# Altium schematic sheet differential receiver.SchDoc
size A; SheetNumber: 1; SheetTotal: 2
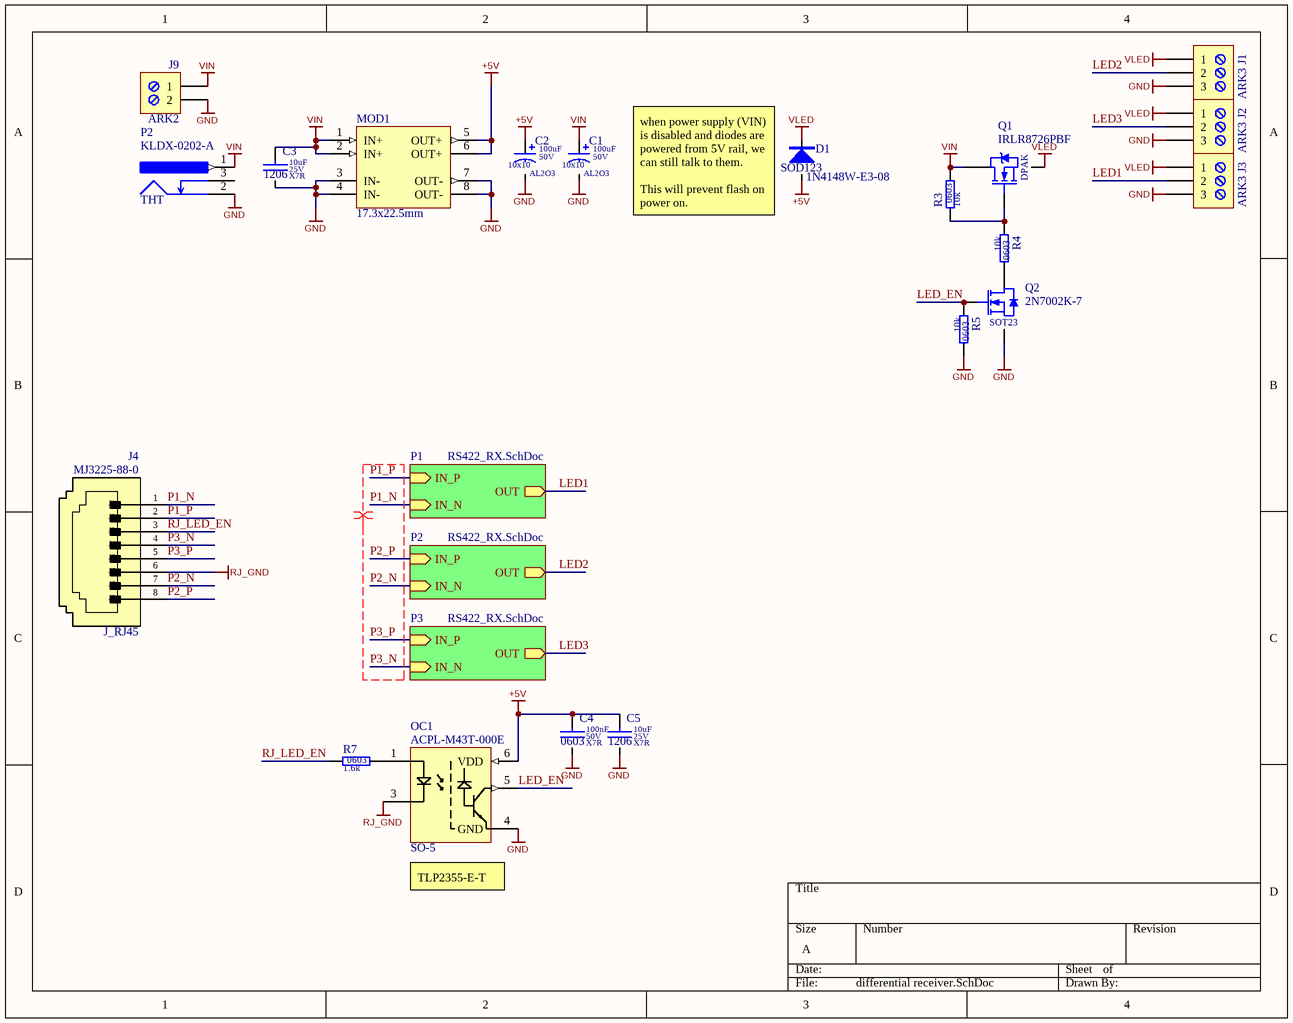
[diagram p0: differential receiver.SchDoc]

## Parts
C1  value 100uF  Dielectric: AL2O3  SCH_Footprint: 10x10  Voltage: 50V  [CE_D_10x10_SMD]  (hidden comment: Electrolytic Capacitor)
C2  value 100uF  Dielectric: AL2O3  SCH_Footprint: 10x10  Voltage: 50V  [CE_D_10x10_SMD]  (hidden comment: Electrolytic Capacitor)
C3  value 10uF  Dielectric: X7R  Voltage: 25V  SCH_Footprint: 1206  [C_1206_3216]  (hidden comment: Ceramic X7R)
C4  value 100nF  Dielectric: X7R  Voltage: 50V  SCH_Footprint: 0603  [C_0603_1608]  (hidden comment: Ceramic X7R)
C5  value 10uF  Dielectric: X7R  Voltage: 25V  SCH_Footprint: 1206  [C_1206_3216]  (hidden comment: Ceramic X7R)
D1  value 1N4148W-E3-08  [SOD123]  (hidden comment: 1N4148W)
J1  ARK3  [J_ARK3]
J2  ARK3  [J_ARK3]
J3  ARK3  [J_ARK3]
J4  value MJ3225-88-0  [J_RJ45_MJ3225-88-0]  (hidden comment: Modular Connector, Modular Jack, 1 x 1 (Port), 8P8C, Cat3)
J9  ARK2  [J_ARK2]
MOD1  SCH_Footprint: 17.3x22.5mm  [MOD_BUCK_MP1584]  (hidden comment: Low cost, Aliexpress-ready DC-DC buck converter using MP1584)
OC1  value ACPL-M43T-000E  [SO-5]  (hidden comment: Optocoupler DC-IN 1-CH Transistor With Base DC-OUT Automotive)
P2  value KLDX-0202-A  SCH_Footprint: THT  [P_KLDX-0202-A]  (hidden comment: DC JACK)
Q1  SCH_Footprint: DPAK  [DPAK_TO252-3_SC63_M]  (hidden comment: IRLR8726PBF)
Q2  SCH_Footprint: SOT23  [SOT23_TO236_SC59]  (hidden comment: 2N7002K-7)
R3  value 10k  SCH_Footprint: 0603  [R_0603_1608]  (hidden comment: Resistor)
R4  value 10k  SCH_Footprint: 0603  [R_0603_1608]  (hidden comment: Resistor)
R5  value 10k  SCH_Footprint: 0603  [R_0603_1608]  (hidden comment: Resistor)
R7  value 1.6k  SCH_Footprint: 0603  [R_0603_1608]  (hidden comment: Resistor)

## Sub-sheets
P1 = RS422_RX.SchDoc: OUT (out), IN_P (in), IN_N (in)
P2 = RS422_RX.SchDoc: OUT (out), IN_P (in), IN_N (in)
P3 = RS422_RX.SchDoc: OUT (out), IN_P (in), IN_N (in)

## Nets
+5V: C2.1 C4.1 C5.1 D1.2 MOD1.5(OUT+) MOD1.6(OUT+) OC1.6(VDD)
GND: C1.2 C2.2 C3.2 C4.2 C5.2 J1.3 J2.3 J3.3 J9.2 MOD1.3(IN-) MOD1.4(IN-) MOD1.7(OUT-) MOD1.8(OUT-) OC1.4(GND) P2.2 Q2.2(S) R5.2
RJ_GND: J4.6 OC1.3
VIN: C1.1 C3.1 J9.1 MOD1.1(IN+) MOD1.2(IN+) P2.1 Q1.2(D) R3.2
VLED: D1.1 J1.1 J2.1 J3.1 Q1.3(S)
LED1: J3.2 ; sheet P1/OUT
LED2: J1.2 ; sheet P2/OUT
LED3: J2.2 ; sheet P3/OUT
LED_EN: OC1.5 Q2.1(G) R5.1
P1_N: J4.1 ; sheet P1/IN_N
P1_P: J4.2 ; sheet P1/IN_P
P2_N: J4.7 ; sheet P2/IN_N
P2_P: J4.8 ; sheet P2/IN_P
P3_N: J4.4 ; sheet P3/IN_N
P3_P: J4.5 ; sheet P3/IN_P
RJ_LED_EN: J4.3 R7.1
NetOC1_1: OC1.1 R7.2
NetQ1_1: Q1.1(G) R3.1 R4.1
NetQ2_3: Q2.3(D) R4.2

Not connected (* = marked no-connect by the designer): P2 3

## Layout directives
differential pair: P1_N, P1_P, P2_N, P2_P, P3_N, P3_P

## Notes on the sheet
- (near D1) when power supply (VIN) is disabled and diodes are powered from 5V rail, we can still talk to them.
  This will prevent flash on power on.
- (near OC1) TLP2355-E-T
- (in symbol J_RJ45_MJ3225-88-0) J1; J2; J3; J5; J6; J7; J8

## Library data of the parts
C1 C2 = CE_100uF_50V_AL2O3_10x10_20: Polarized Capacitor; Manufacturer: Nichicon; Manufacturer Part Number: UUX1H101MNL1GS; Tolerance (%): 20; Part Number: CE_100uF_50V_AL2O3_10x10_20; HelpURL: https://datasheet.octopart.com/UUX1H101MNL1GS-Nichicon-datasheet-62047998.pdf; Supplier 1: TME; Supplier Part Number 1: UUX1H101MNL1GS; Supplier 2: RS Components; Supplier Part Number 2: 7393107; Supplier 3: Farnell; Supplier Part Number 3: 2841943; Supplier 4: Mouser; Supplier Part Number 4: 647-UUX1H101MNL1GS; Supplier 5: Digi-Key; Supplier Part Number 5: 493-6269-1-ND; Supplier 6: LCSC
C3 C5 = C_10uF_25V_X7R_1206_10: Capacitor; Manufacturer: Samsung; Manufacturer Part Number: CL31B106KAHNNNE; Tolerance (%): 10; Part Number: C_10uF_25V_X7R_1206_10; HelpURL: http://www.tme.eu/pl/Document/4a42202b32dab16128fe107dd69598cc/samsung-chip-cap.pdf; Supplier 1: TME; Supplier Part Number 1: CL31B106KAHNNNE; Supplier 2: RS Components; Supplier Part Number 2: 766-6773; Supplier 3: Farnell; Supplier Part Number 3: 3013526; Supplier 4: Mouser; Supplier Part Number 4: 187-CL31B106KAHNNNE; Supplier 5: Digi-Key; Supplier Part Number 5: 1276-1804-1-ND; Supplier 6: LCSC
C4 = C_100nF_50V_X7R_0603_5: Capacitor; Manufacturer: Samsung; Manufacturer Part Number: CL10B104JB8NNNC; Tolerance (%): 5; Part Number: C_100nF_50V_X7R_0603_5; HelpURL: http://www.tme.eu/pl/Document/4a42202b32dab16128fe107dd69598cc/samsung-chip-cap.pdf; Supplier 1: TME; Supplier Part Number 1: CL10B104JB8NNNC; Supplier 2: RS Components; Supplier Part Number 2: 7665455; Supplier 3: Farnell; Supplier 4: Mouser; Supplier 5: Digi-Key; Supplier Part Number 5: 1276-1033-1-ND; Supplier 6: LCSC; Supplier Part Number 6: C24452
D1 = D_1N4148W_0A15_75V_SOD123: Manufacturer: Vishay; Voltage: 75; Current: 0.15A; SCH_Footprint: SOD123; Part Number: D_1N4148W_0A15_75V_SOD123; HelpURL: https://datasheet.octopart.com/1N4148W-E3-08-Vishay-datasheet-17291302.pdf; Manufacturer Part Number: 1N4148W-E3-08; Supplier 1: TME; Supplier Part Number 1: 1N4148W-E3-08; Supplier 2: RS Components; Supplier Part Number 2: 7003671; Supplier 3: Farnell; Supplier Part Number 3: 2433353; Supplier 4: Mouser; Supplier Part Number 4: 78-1N4148W-E3-08; Supplier 5: Digi-Key; Supplier Part Number 5: 1N4148W-E3-08CT-ND; Supplier 6: LCSC
J1-J3 = J_TB-5.0-P-3P: ARK Screw terminal, 3-Pin; Manufacturer: DEGSON ELECTRONICS; Value: DG301-5.0-03P-12-18A(H); SCH_Footprint: ARK3; Part Number: J_TB-5.0-P-3P; HelpURL: https://datasheet.octopart.com/DG301-5.0-03P-12-18A%28H%29-Degson-datasheet-17801202.pdf; Manufacturer Part Number: DG301-5.0-03P-12-18A(H); Supplier 1: TME; Supplier Part Number 1: DG301-5.0-3/6B; Supplier 2: RS Components; Supplier 3: Farnell; Supplier 4: Mouser; Supplier 5: Digi-Key; Supplier 6: LCSC
J4 = J_RJ45_MJ3225-88-0: Manufacturer: Global Connector Technology; SCH_Footprint: J_RJ45; Part Number: J_RJ45_MJ3225-88-0; HelpURL: https://www.farnell.com/cad/3781788.pdf; Manufacturer Part Number: MJ3225-88-0; Supplier 1: TME; Supplier 2: RS Components; Supplier 3: Farnell; Supplier Part Number 3: 4071641; Supplier 4: Mouser; Supplier 5: Digi-Key; Supplier 6: LCSC; Supplier 7: Newark; Supplier Part Number 7: 61AK4308
J9 = J_TB-5.0-P-2P: ARK Screw terminal, 2-Pin; Manufacturer: DEGSON ELECTRONICS; Value: DG301-5.0-02P-12-18A(H); SCH_Footprint: ARK2; Part Number: J_TB-5.0-P-2P; HelpURL: https://datasheet.octopart.com/DG301-5.0-03P-12-18A%28H%29-Degson-datasheet-17801202.pdf; Manufacturer Part Number: DG301-5.0-02P-12-18A(H); Supplier 1: TME; Supplier Part Number 1: DG301-5.0-2/6B; Supplier 2: RS Components; Supplier 3: Farnell; Supplier 4: Mouser; Supplier 5: Digi-Key; Supplier 6: LCSC
MOD1 = MOD_BUCK_MP1584: Value: -; Part Number: MOD_BUCK_MP1584; HelpURL: https://pl.aliexpress.com/item/32341006065.html; Manufacturer: -; Manufacturer Part Number: -; Supplier 1: TME; Supplier 2: RS Components; Supplier 3: Farnell; Supplier 4: Mouser; Supplier 5: Digi-Key; Supplier 6: LCSC; Supplier 7: -; Supplier Part Number 7: -
OC1 = OC_ACPL-M43T-000E: Manufacturer: Broadcom; SCH_Footprint: SO-5; Part Number: OC_ACPL-M43T-000E; HelpURL: https://datasheet.octopart.com/ACPL-M43T-000E-Broadcom-datasheet-68302489.pdf; Manufacturer Part Number: ACPL-M43T-000E; Supplier 1: TME; Supplier 2: RS Components; Supplier 3: Farnell; Supplier Part Number 3: 1244509; Supplier 4: Mouser; Supplier Part Number 4: 630-ACPL-M43T-000E; Supplier 5: Digi-Key; Supplier Part Number 5: 516-2256-5-ND; Supplier 6: LCSC
P2 = P_KLDX-0202-A: Typical 3-pin jack power connector with switch; Manufacturer: Kycon; Part Number: P_KLDX-0202-A; HelpURL: http://www.kycon.com/2013Catalogpage/DC%20Power/KLDX_0202.pdf; Manufacturer Part Number: KLDX-0202-A; Supplier 1: TME; Supplier 2: RS Components; Supplier 3: Farnell; Supplier Part Number 3: 2839850; Supplier 4: Mouser; Supplier Part Number 4: 806-KLDX-0202-A; Supplier 5: Digi-Key; Supplier Part Number 5: 2092-KLDX-0202-A-ND; Supplier 6: LCSC
Q1 = QNS_IRLR8726PBF: Manufacturer: Infineon; Type: N-MOS; Voltage: 30V; Current: 86A; Value: IRLR8726PBF; Part Number: QNS_IRLR8726PBF; HelpURL: http://www.mouser.com/ds/2/196/irlr8726pbf-938054.pdf; Manufacturer Part Number: IRLR8726PBF; Supplier 1: TME; Supplier Part Number 1: IRLR8726PBF; Supplier 2: RS Components; Supplier 3: Farnell; Supplier 4: Mouser; Supplier Part Number 4: 942-IRLR8726PBF; Supplier 5: Digi-Key; Supplier Part Number 5: IRLR8726PBF-ND; Supplier 6: LCSC
Q2 = QN_2N7002K-7: Manufacturer: Diodes Inc; Type: N-MOS; Voltage: 60V; Current: 0A8; Value: 2N7002K-7; Part Number: QN_2N7002K-7; HelpURL: http://datasheet.octopart.com/2N7002K-7-Diodes-Inc.-datasheet-12515815.pdf; Manufacturer Part Number: 2N7002K-7; Supplier 1: TME; Supplier 2: RS Components; Supplier Part Number 2: 7703383; Supplier 3: Farnell; Supplier Part Number 3: 1713825; Supplier 4: Mouser; Supplier Part Number 4: 621-2N7002K-7; Supplier 5: Digi-Key; Supplier Part Number 5: 2N7002K-7DICT-ND; Supplier 6: LCSC
R3-R5 = R_10k_0603_1: Manufacturer: Vishay; Manufacturer Part Number: CRCW060310K0FKTA; Voltage: 75V; Power: 100mW; Tolerance: 1%; Part Number: R_10k_0603_1; HelpURL: https://octopart.com/datasheet/crcw060310k0fkta-vishay-39447548; Supplier 1: TME; Supplier Part Number 1: CRCW060310K0FKTABC; Supplier 2: RS Components; Supplier 3: Farnell; Supplier Part Number 3: 1652827; Supplier 4: Mouser; Supplier Part Number 4: 71-CRCW0603-10K; Supplier 5: Digi-Key; Supplier Part Number 5: 541-2980-1-ND; Supplier 6: LCSC
R7 = R_1.6k_0603_1_AECQ0: Manufacturer: Panasonic; Manufacturer Part Number: ERJ-3EKF1601V; Voltage: 75V; Power: 100mW; Tolerance: 1%; Part Number: R_1.6k_0603_1_AECQ0; HelpURL: https://industrial.panasonic.com/cdbs/www-data/pdf/RDA0000/AOA0000C304.pdf; Supplier 1: TME; Supplier Part Number 1: ERJ3EKF1601V; Supplier 2: RS Components; Supplier 3: Farnell; Supplier Part Number 3: 2303159; Supplier 4: Mouser; Supplier Part Number 4: 667-ERJ-3EKF1601V; Supplier 5: Digi-Key; Supplier Part Number 5: P1.60KHCT-ND; Supplier 6: LCSC